# Altium schematic sheet Tay_Cam.SchDoc (part 1 of 3)
size 1270 x 558 mm; SheetNumber: 3; SheetTotal: 3
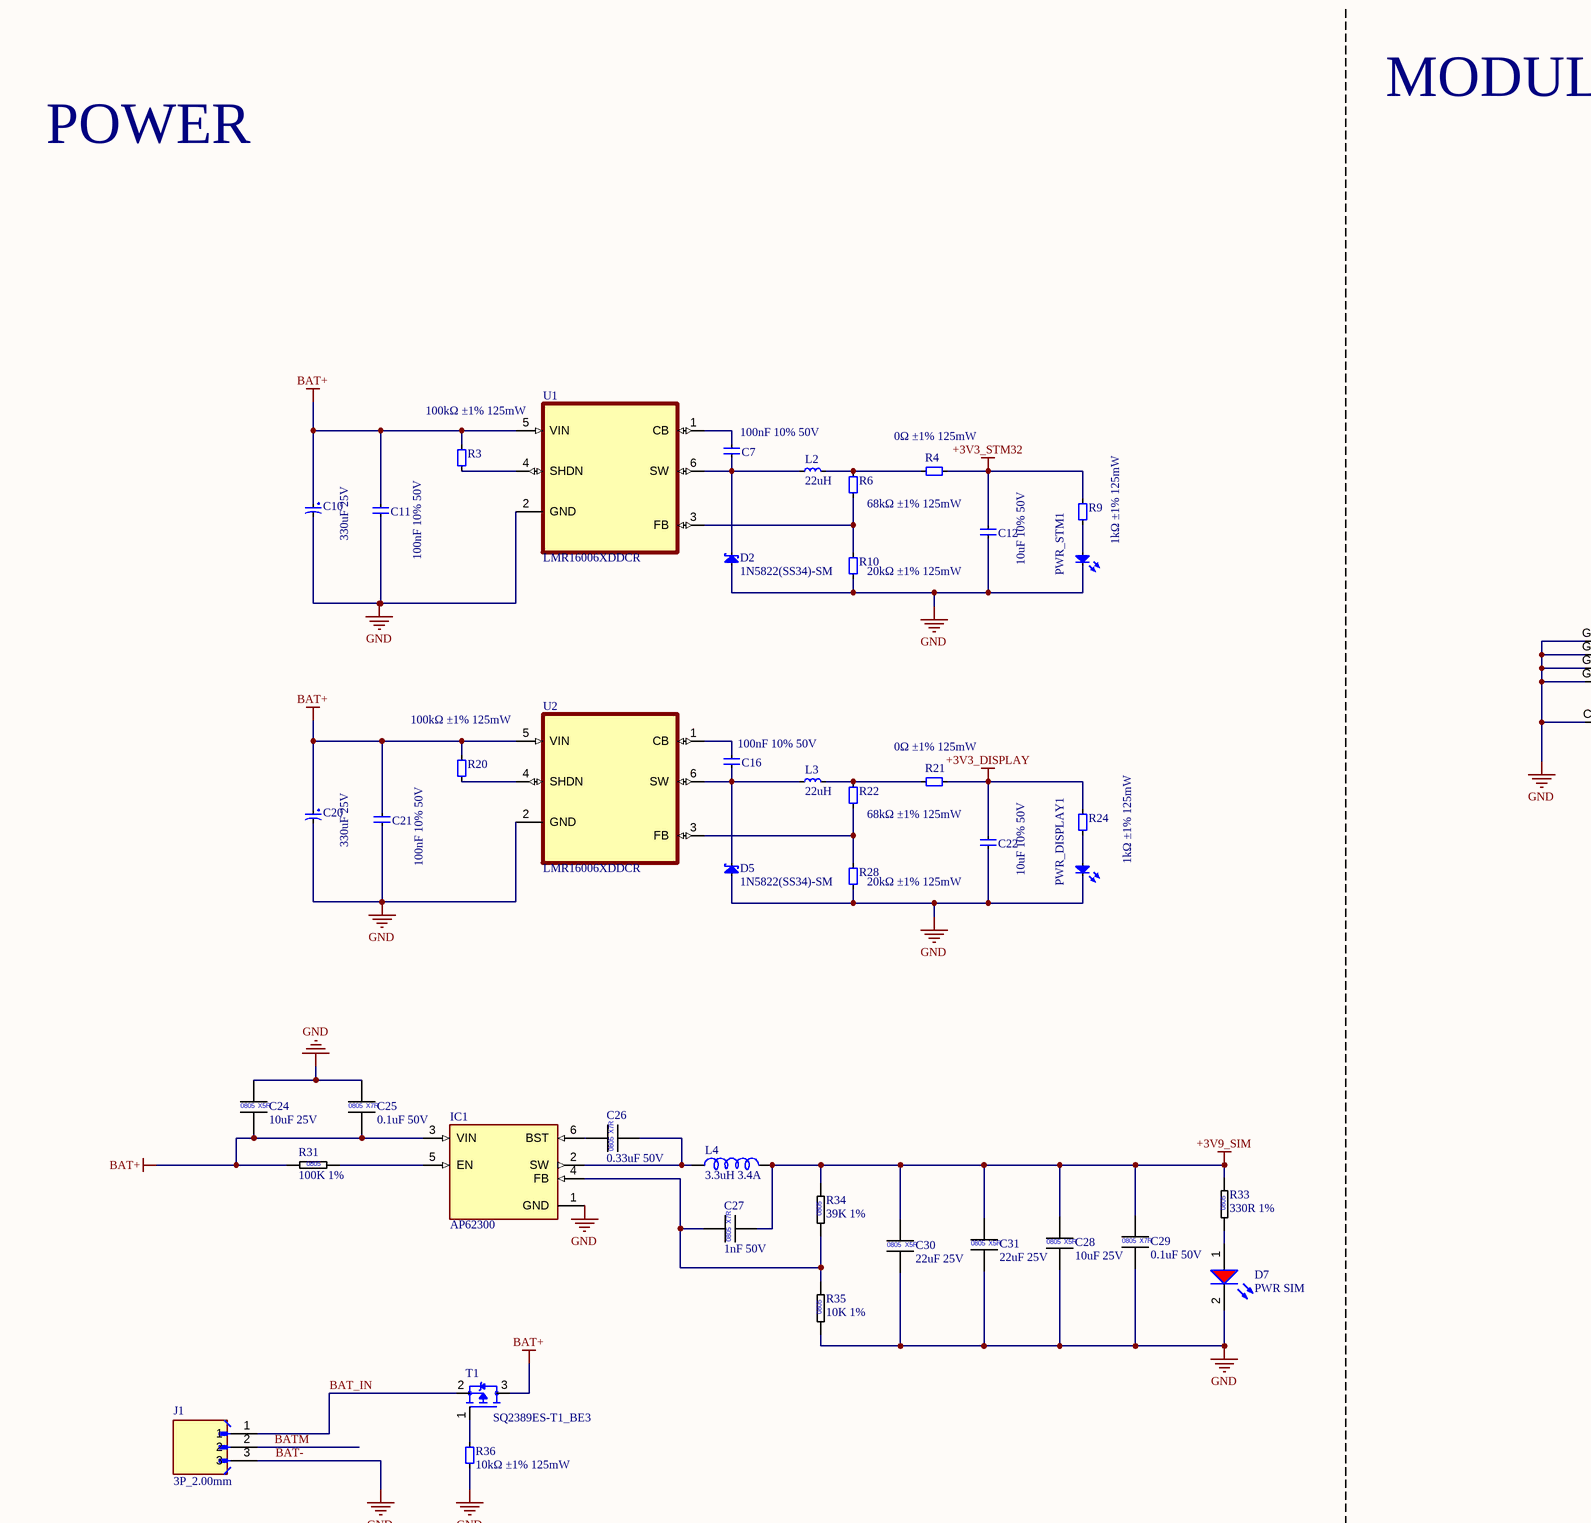
[diagram p0: Tay_Cam.SchDoc, top column 1 of 4]
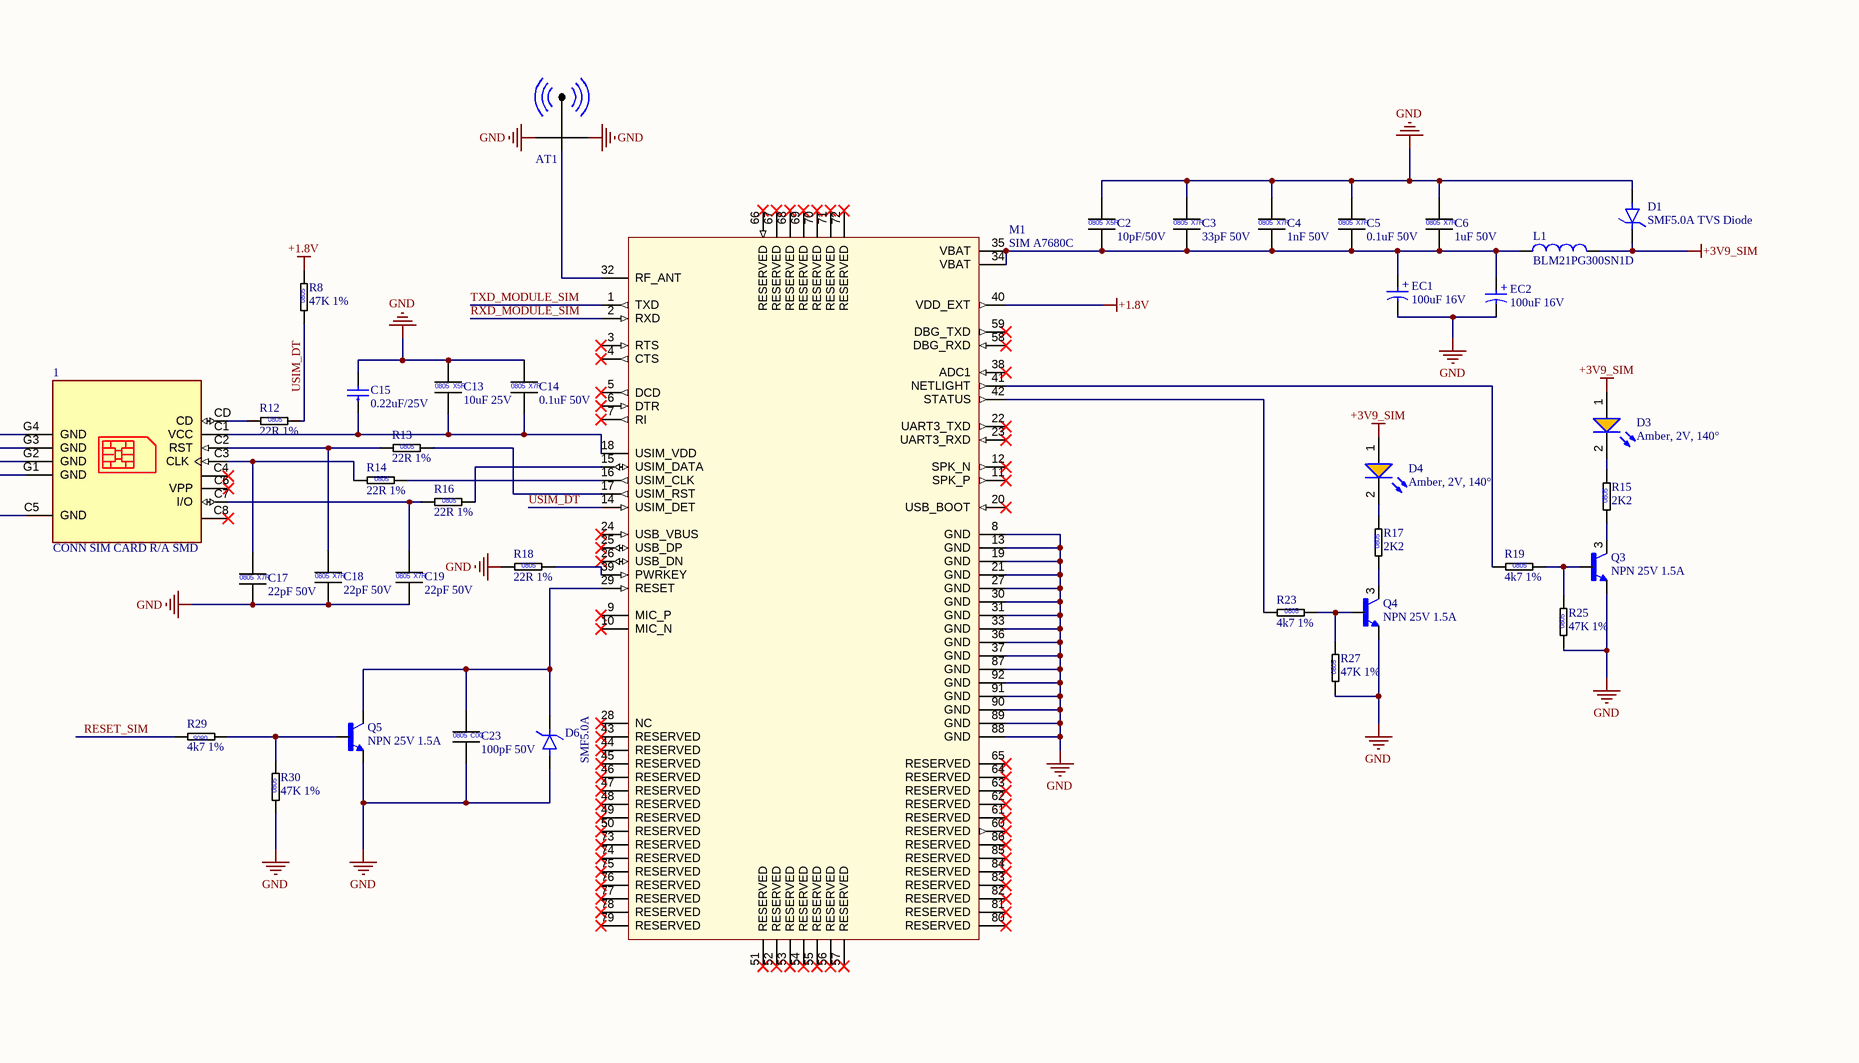
[diagram p1: Tay_Cam.SchDoc, top column 2 of 4]
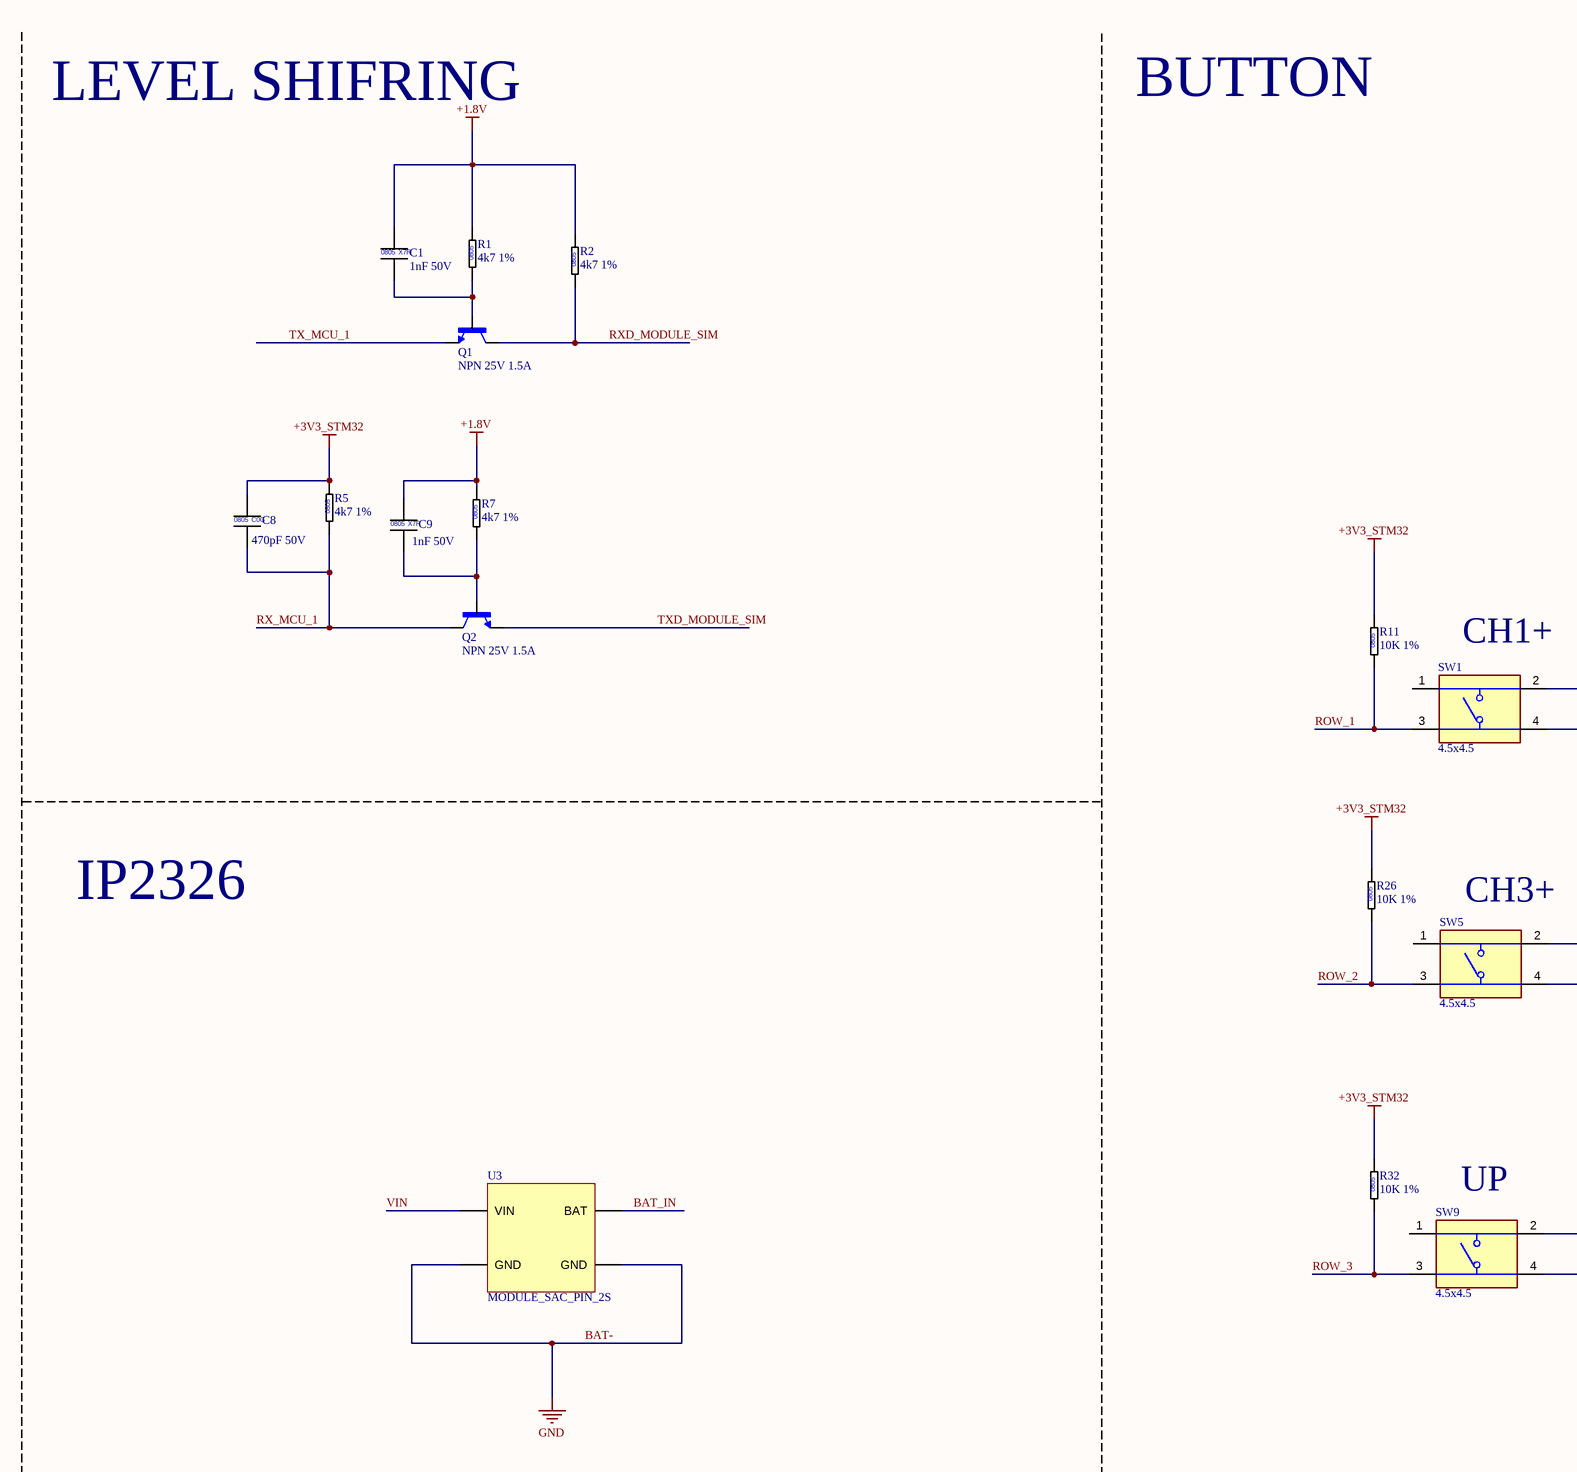
[diagram p2: Tay_Cam.SchDoc, top column 3 of 4]
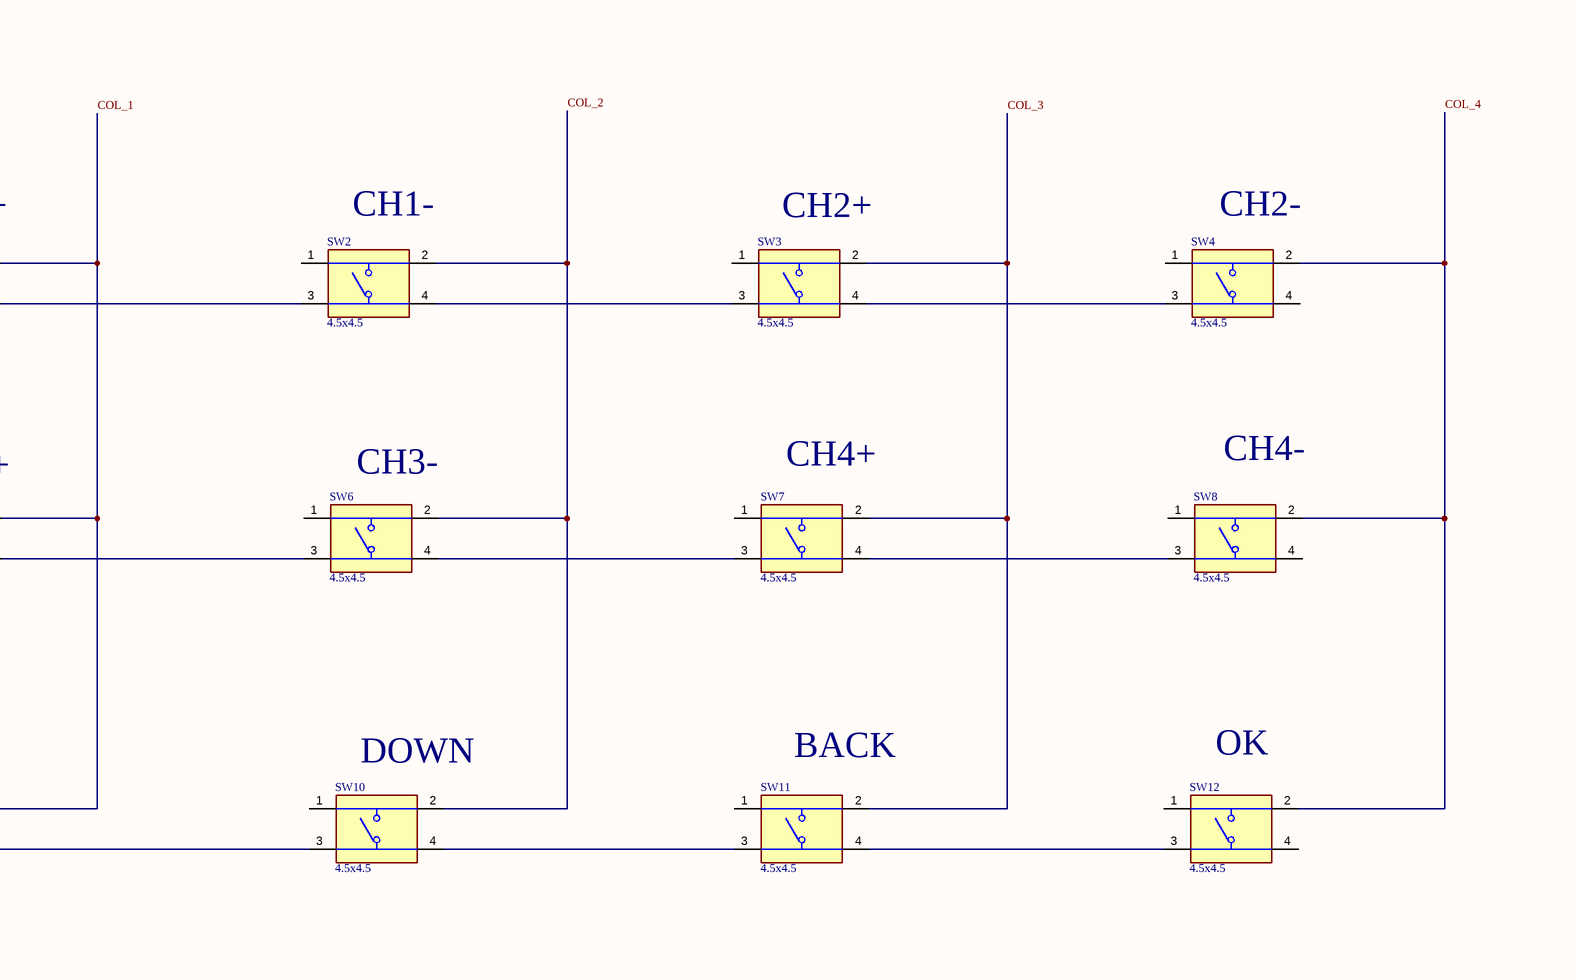
[diagram p3: Tay_Cam.SchDoc, top column 4 of 4]
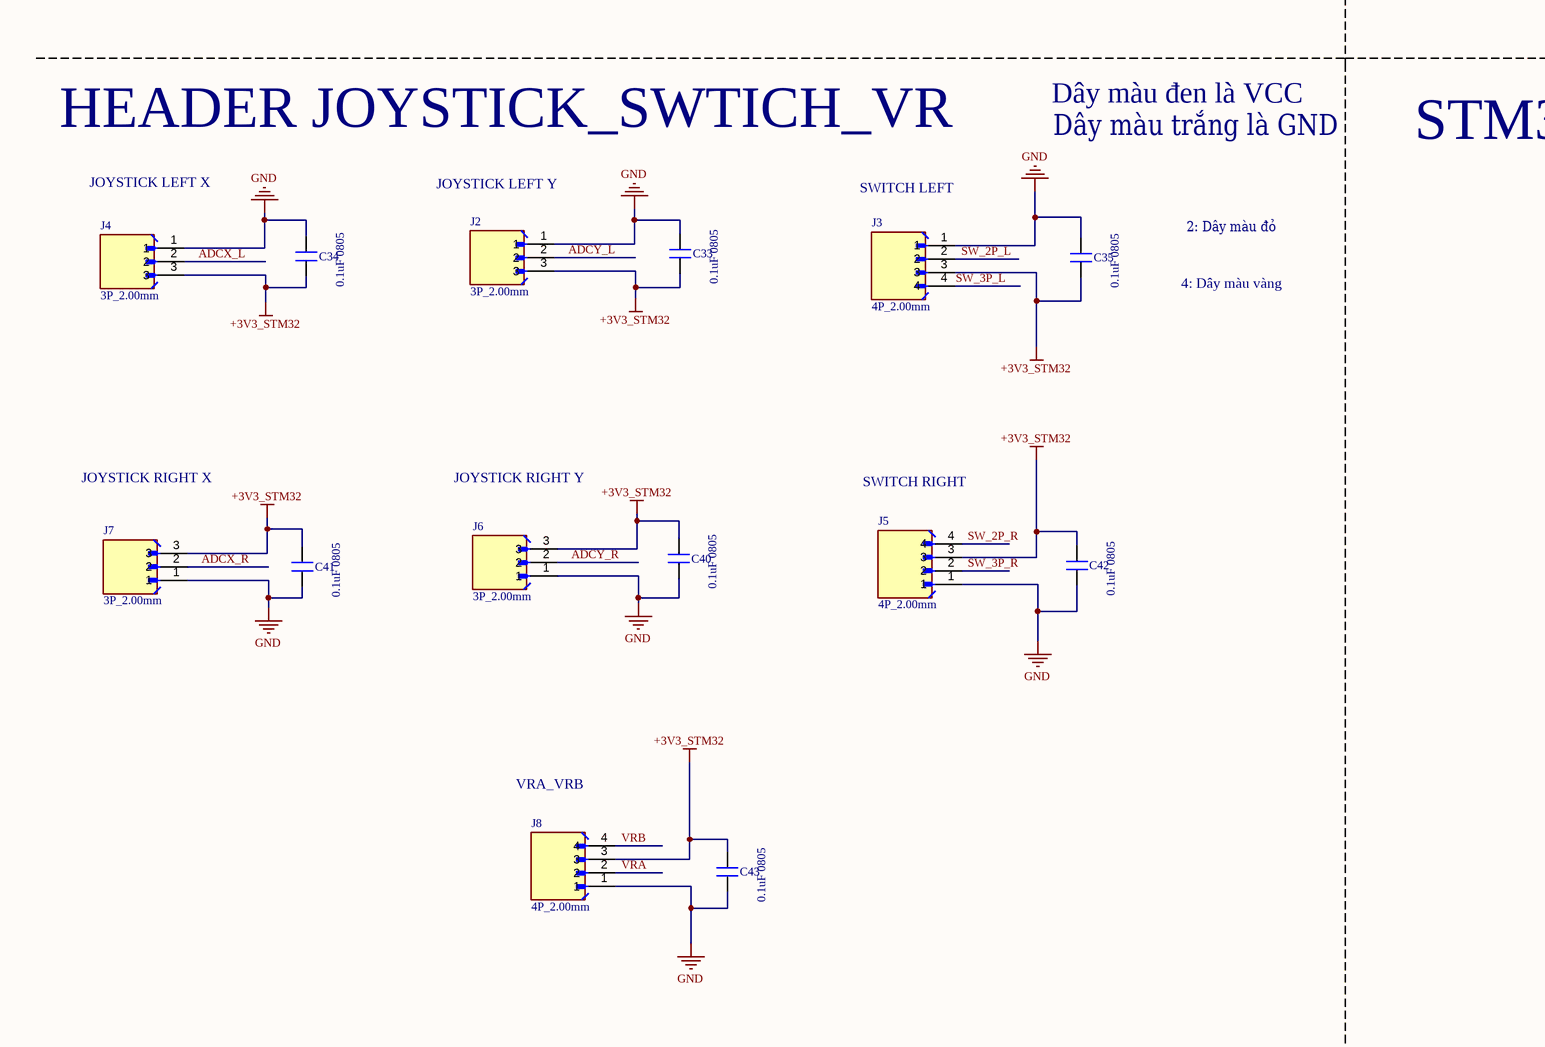
[diagram p4: Tay_Cam.SchDoc, bottom column 1 of 4]
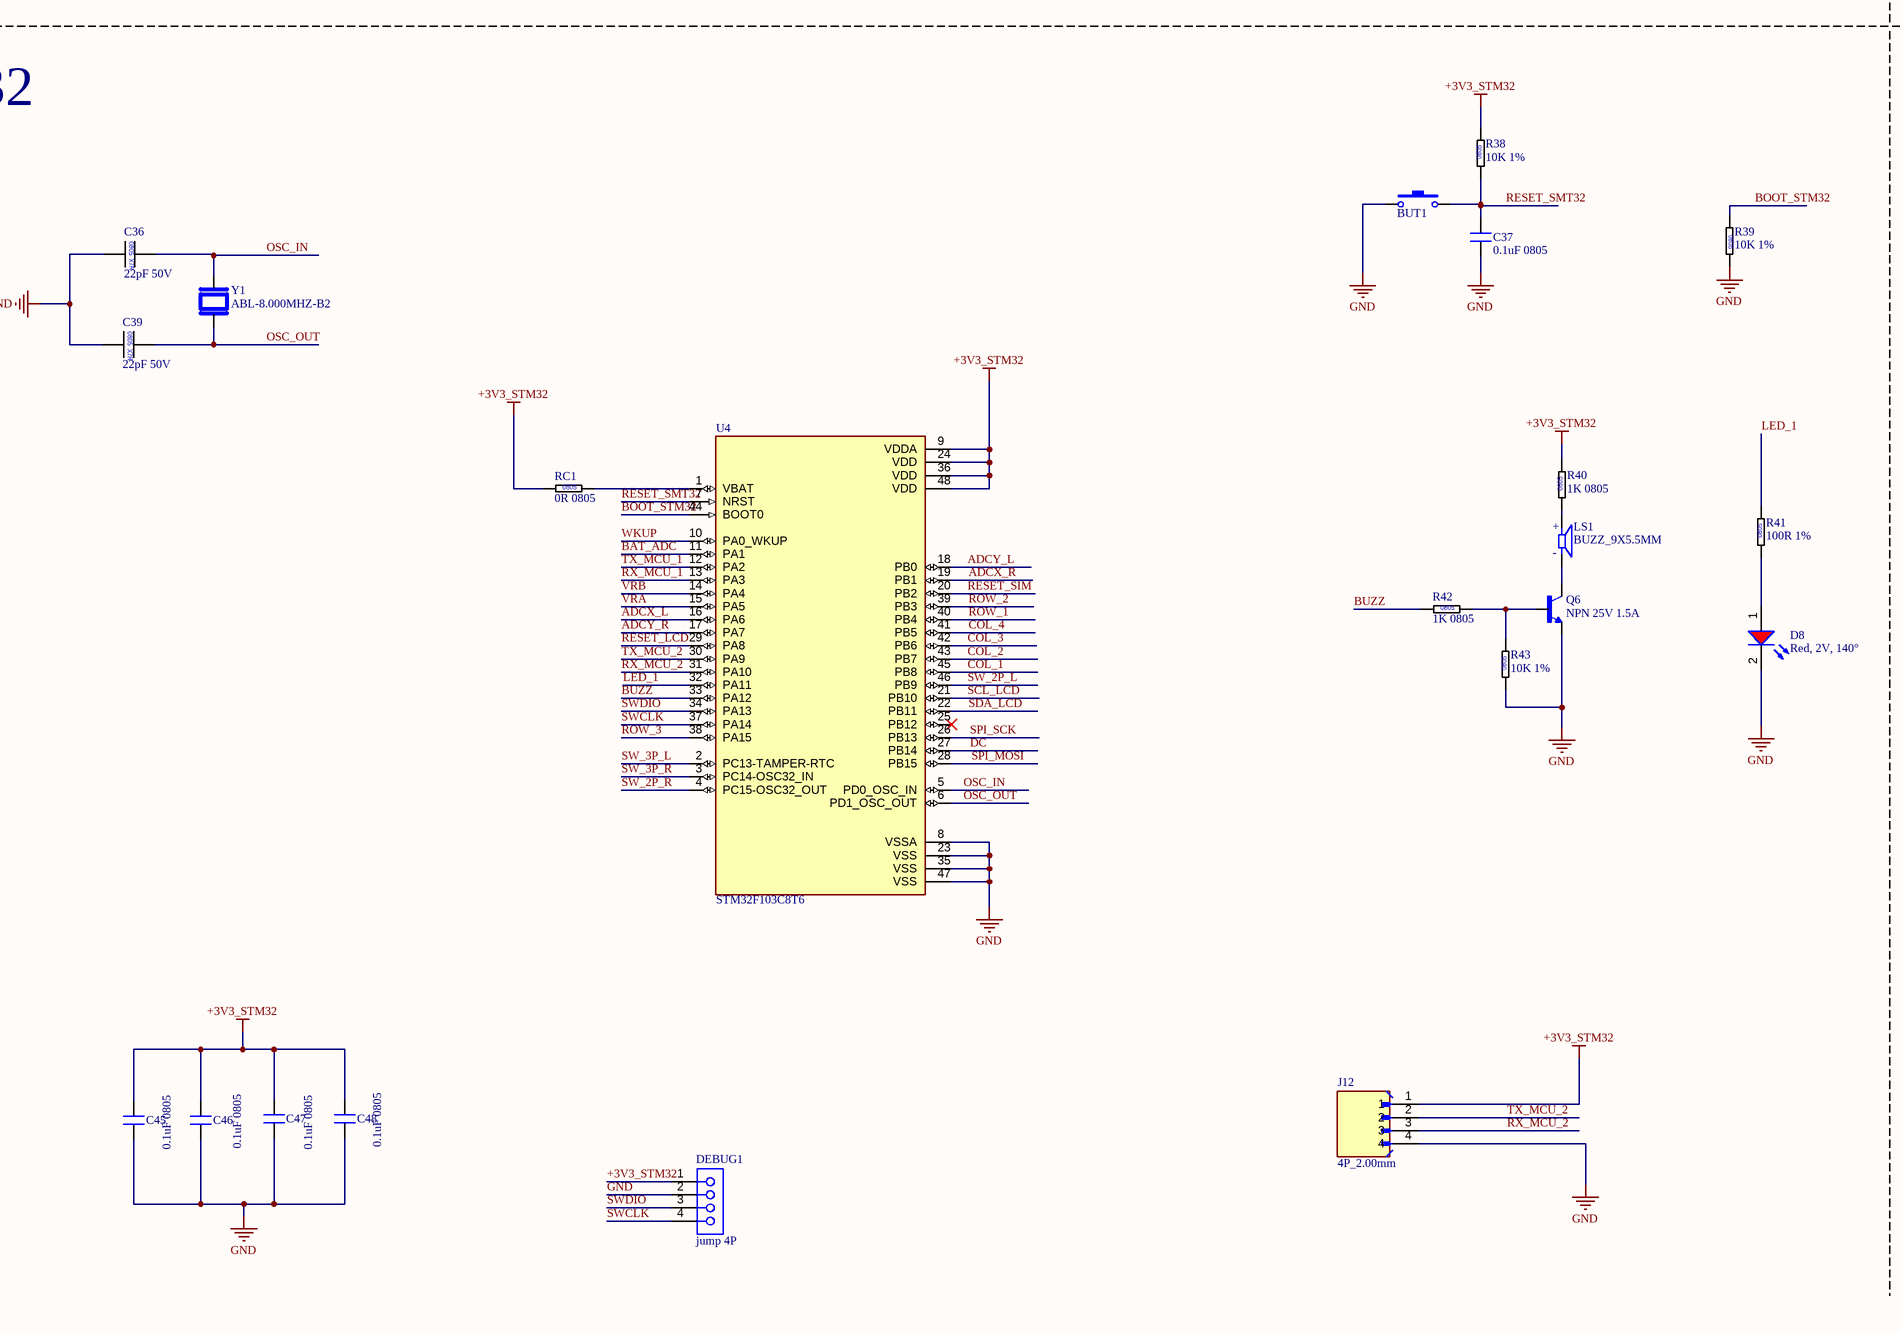
[diagram p5: Tay_Cam.SchDoc, bottom column 2 of 4]
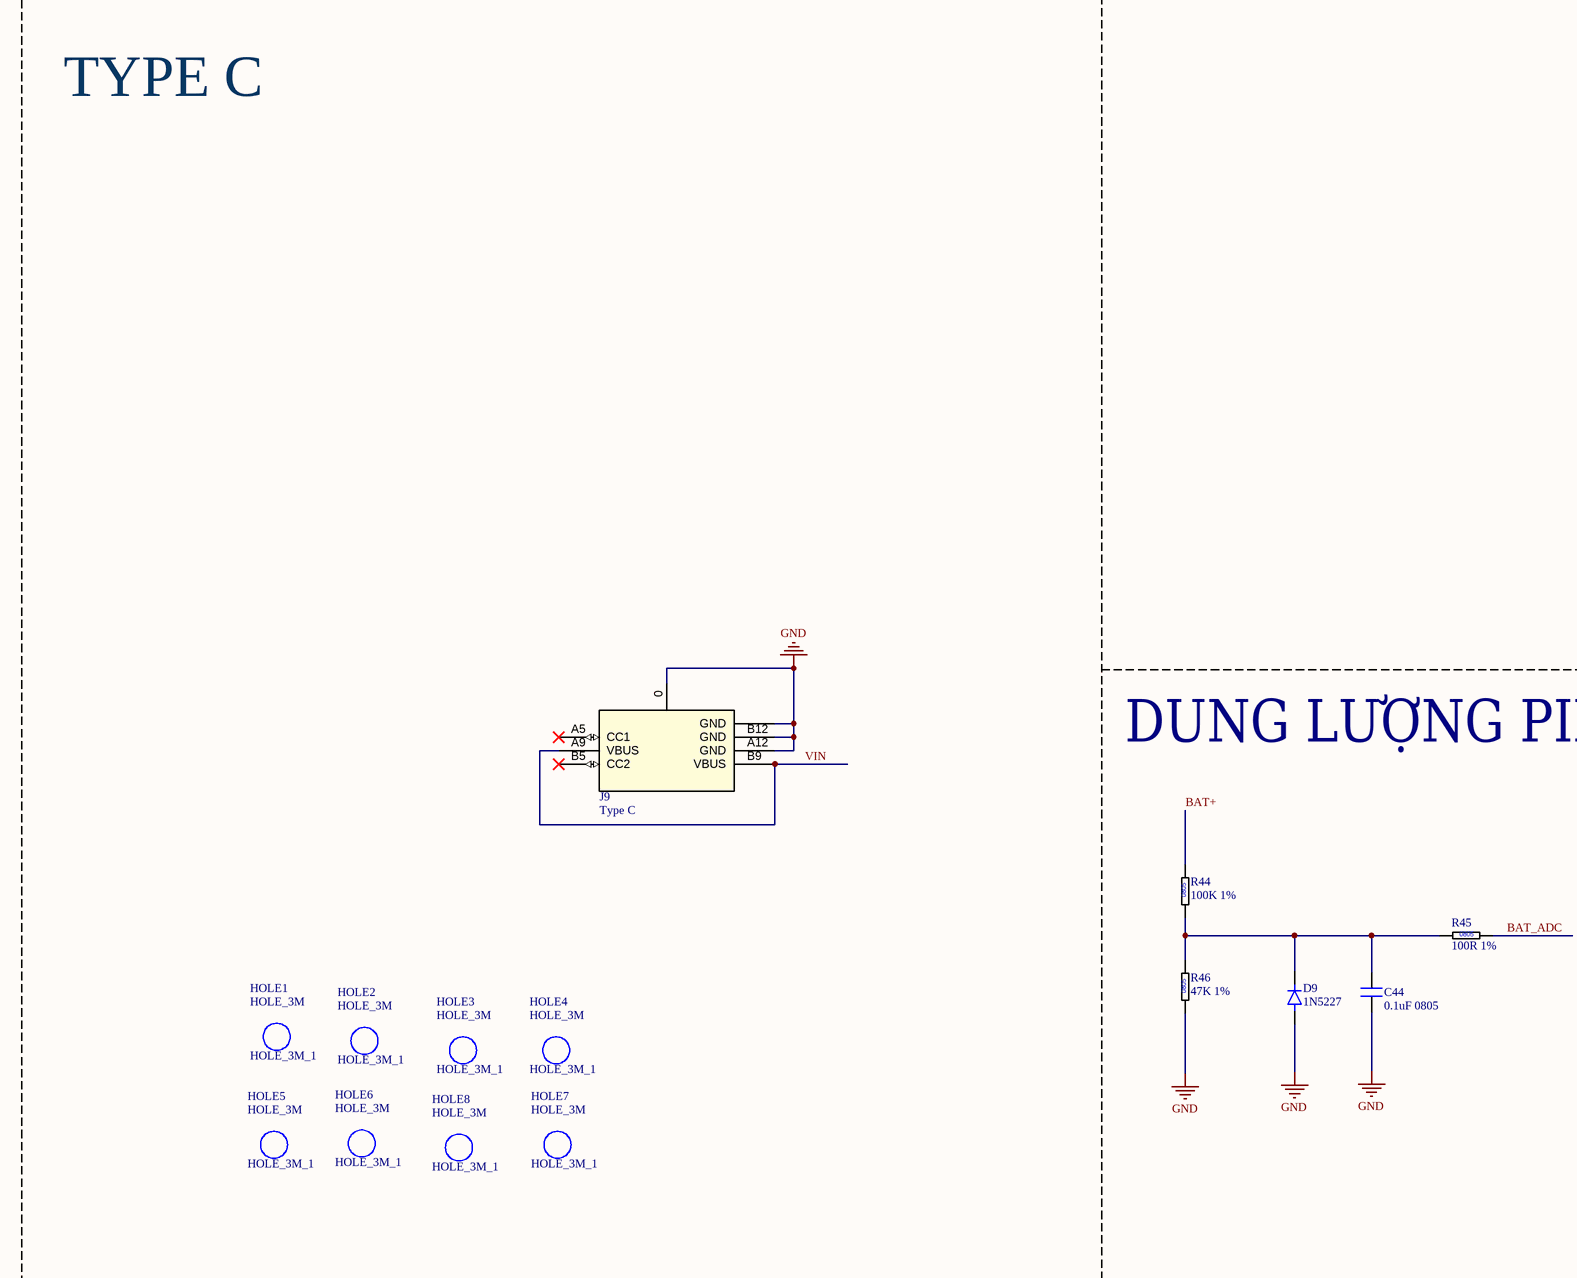
[diagram p6: Tay_Cam.SchDoc, bottom column 3 of 4]
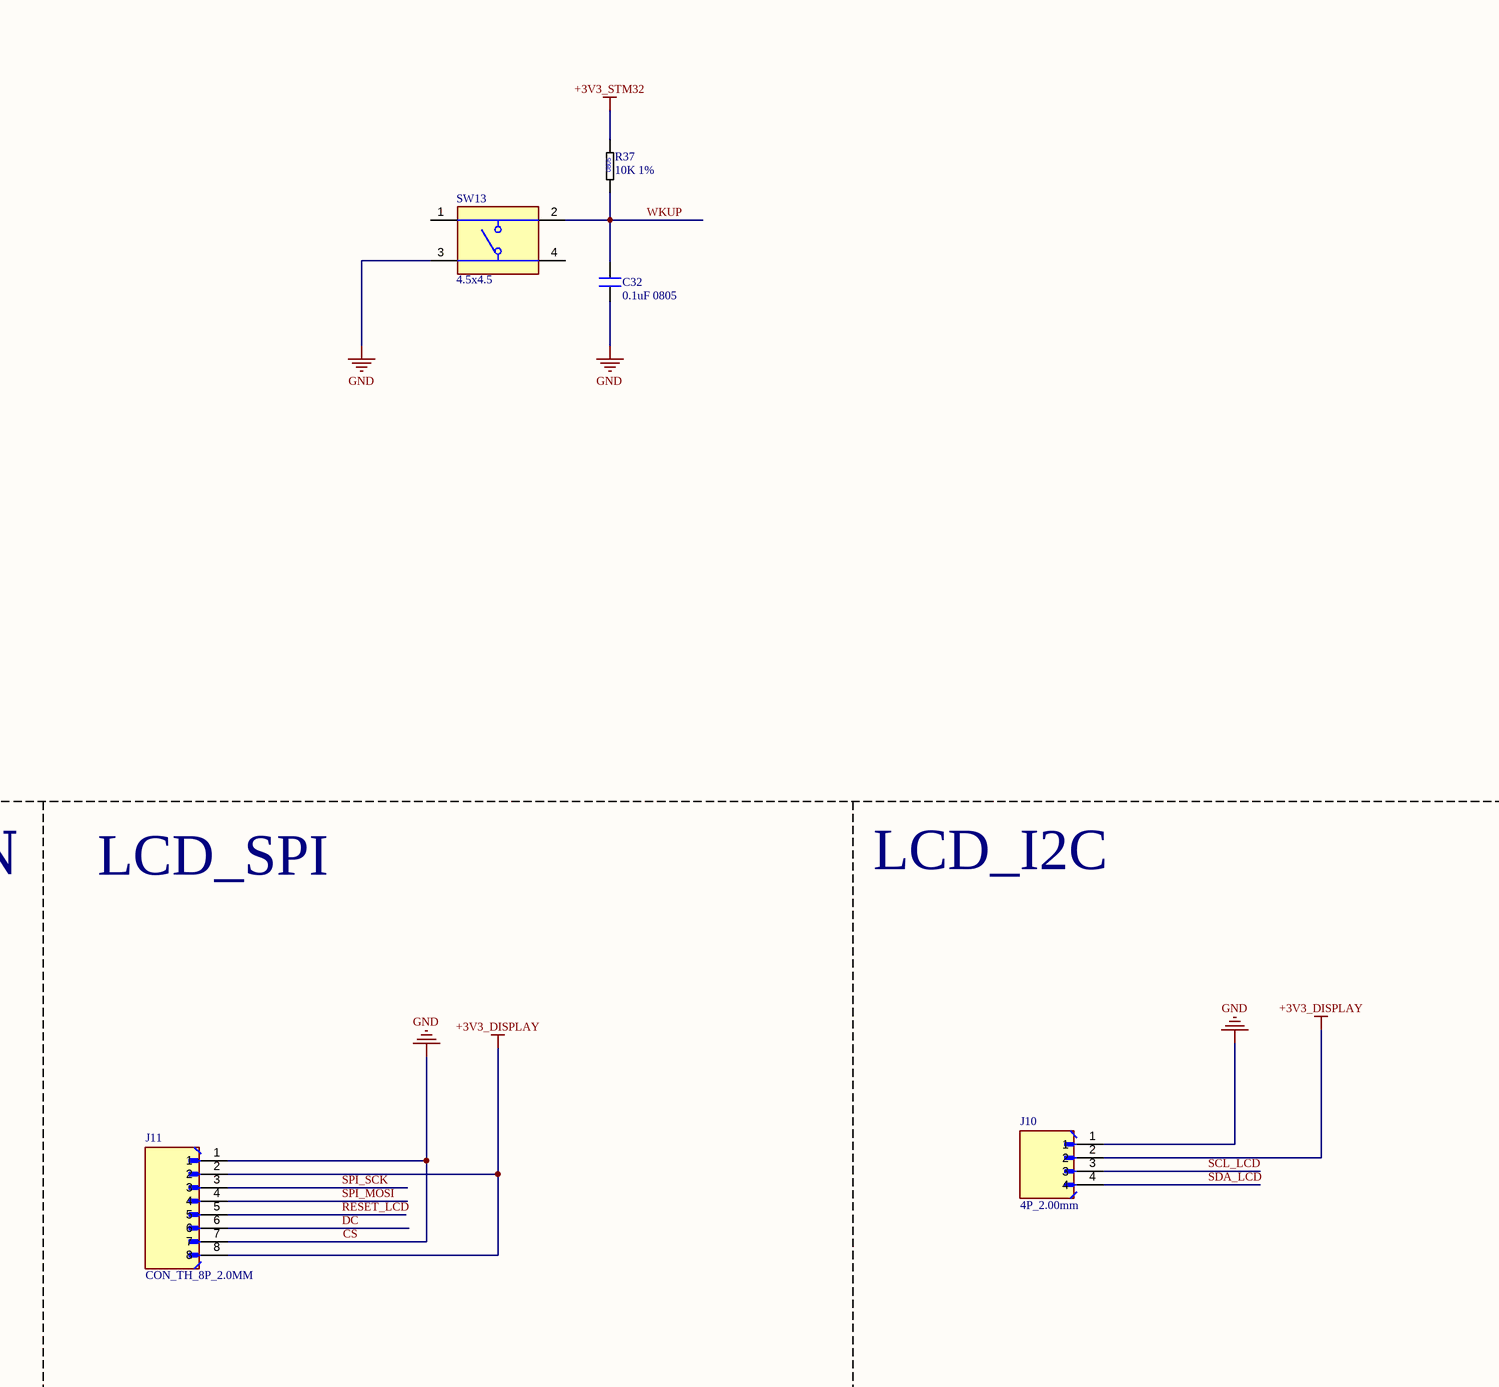
[diagram p7: Tay_Cam.SchDoc, bottom column 4 of 4]

## Parts
1  CONN SIM CARD R/A SMD  [SIM HOLDER 9P]
AT1  Antenna_IPEX  [IPEX]  (value not drawn)
BUT1  Nut Nhan 2 Chan SMD 3x6x2.5  [Nut Nhan 2 Chan SMD 3x6x2.5]  (value not drawn)
C1  1nF 50V  [CAP-CER_0805_L2W1.25H0.6_Wave]
C2  10pF/50V  [CAP-CER_0805_L2W1.25H0.6_Wave]
C3  33pF 50V  [CAP-CER_0805_L2W1.25H0.6_Wave]
C4  1nF 50V  [CAP-CER_0805_L2W1.25H0.6_Wave]
C5  0.1uF 50V  [CAP-CER_0805_L2W1.25H0.6_Wave]
C6  1uF 50V  [CAP-CER_0805_L2W1.25H0.8_Wave]
C7  100nF 10% 50V  [C-CHIP-0805-T0.95-SM]
C8  470pF 50V  [CAP-CER_0805_L2W1.25H0.6_Wave]
C9  1nF 50V  [CAP-CER_0805_L2W1.25H0.6_Wave]
C10  330uF 25V  [C-ELEC-ALU-F-D8.0-H10.2-SM]
C11  100nF 10% 50V  [C-CHIP-0805-T0.95-SM]
C12  10uF 10% 50V  [C-CHIP-1206-T1.00-SM]
C13  10uF 25V  [CAP-CER_0805_L2W1.25H0.8_Wave]
C14  0.1uF 50V  [CAP-CER_0805_L2W1.25H0.6_Wave]
C15  0.22uF/25V  [CAP-CER0805-1.4H]
C16  100nF 10% 50V  [C-CHIP-0805-T0.95-SM]
C17  22pF 50V  [CAP-CER_0805_L2W1.25H0.6_Wave]
C18  22pF 50V  [CAP-CER_0805_L2W1.25H0.6_Wave]
C19  22pF 50V  [CAP-CER_0805_L2W1.25H0.6_Wave]
C20  330uF 25V  [C-ELEC-ALU-F-D8.0-H10.2-SM]
C21  100nF 10% 50V  [C-CHIP-0805-T0.95-SM]
C22  10uF 10% 50V  [C-CHIP-1206-T1.00-SM]
C23  100pF 50V  [CAP-CER_0805_L2W1.25H0.6_Wave]
C24  10uF 25V  [CAP-CER_0805_L2W1.25H0.8_Wave]
C25  0.1uF 50V  [CAP-CER_0805_L2W1.25H0.6_Wave]
C26  0.33uF 50V  [CAP-CER_0805_L2W1.25H0.6_Wave]
C27  1nF 50V  [CAP-CER_0805_L2W1.25H0.6_Wave]
C28  10uF 25V  [CAP-CER_0805_L2W1.25H0.8_Wave]
C29  0.1uF 50V  [CAP-CER_0805_L2W1.25H0.6_Wave]
C30  22uF 25V  [CAP-CER_0805_L2W1.25H0.6_Wave]
C31  22uF 25V  [CAP-CER_0805_L2W1.25H0.6_Wave]
C32  0.1uF 0805  [CAP-CER_0603_L1.6W0.8H0.8_Wave]
C33  0.1uF 0805  [CAP-CER_0603_L1.6W0.8H0.8_Wave]
C34  0.1uF 0805  [CAP-CER_0603_L1.6W0.8H0.8_Wave]
C35  0.1uF 0805  [CAP-CER_0603_L1.6W0.8H0.8_Wave]
C36  22pF 50V  [CAP-CER_0805_L2W1.25H0.6_Wave]
C37  0.1uF 0805  [CAP-CER_0603_L1.6W0.8H0.8_Wave]
C39  22pF 50V  [CAP-CER_0805_L2W1.25H0.6_Wave]
C40  0.1uF 0805  [CAP-CER_0603_L1.6W0.8H0.8_Wave]
C41  0.1uF 0805  [CAP-CER_0603_L1.6W0.8H0.8_Wave]
C42  0.1uF 0805  [CAP-CER_0603_L1.6W0.8H0.8_Wave]
C43  0.1uF 0805  [CAP-CER_0603_L1.6W0.8H0.8_Wave]
C44  0.1uF 0805  [CAP-CER_0603_L1.6W0.8H0.8_Wave]
C45  0.1uF 0805  [CAP-CER_0603_L1.6W0.8H0.8_Wave]
C46  0.1uF 0805  [CAP-CER_0603_L1.6W0.8H0.8_Wave]
C47  0.1uF 0805  [CAP-CER_0603_L1.6W0.8H0.8_Wave]
C48  0.1uF 0805  [CAP-CER_0603_L1.6W0.8H0.8_Wave]
D1  SMF5.0A TVS Diode  [SOD-123]
D2  1N5822(SS34)-SM  [SMA-J_DO-214AC]
D3  Amber, 2V, 140°  [LED_0805_AMBER]
D4  Amber, 2V, 140°  [LED_0805_AMBER]
D5  1N5822(SS34)-SM  [SMA-J_DO-214AC]
D6  SMF5.0A  [SOD-123F/SOD-123FL]
D7  PWR SIM  [LED_0805_RED]
D8  Red, 2V, 140°  [LED_0805_RED]
D9  1N5227  [DIODE-SWITCHING_1N4148UR-1]
DEBUG1  jump 4P  [JUMP_M_1Sx4P_2.54MM]
EC1  100uF 16V  [CAP_ALU;SMD,D6.3H5.8]
EC2  100uF 16V  [CAP_ALU;SMD,D6.3H5.8]
HOLE1  HOLE_3M_1  [HOLE_M3_1]
HOLE2  HOLE_3M_1  [HOLE_M3_1]
HOLE3  HOLE_3M_1  [HOLE_M3_1]
HOLE4  HOLE_3M_1  [HOLE_M3_1]
HOLE5  HOLE_3M_1  [HOLE_M3_1]
HOLE6  HOLE_3M_1  [HOLE_M3_1]
HOLE7  HOLE_3M_1  [HOLE_M3_1]
HOLE8  HOLE_3M_1  [HOLE_M3_1]
IC1  AP62300  [SOT-23-6]
J1  3P_2.00mm  [JST_B3B-PH-K-S(LF)(SN)]
J2  3P_2.00mm  [JST_B3B-PH-K-S(LF)(SN)]
J3  4P_2.00mm  [JST_B4B-PH-K-S(LF)(SN)]
J4  3P_2.00mm  [JST_B3B-PH-K-S(LF)(SN)]
J5  4P_2.00mm  [JST_B4B-PH-K-S(LF)(SN)]
J6  3P_2.00mm  [JST_B3B-PH-K-S(LF)(SN)]
J7  3P_2.00mm  [JST_B3B-PH-K-S(LF)(SN)]
J8  4P_2.00mm  [JST_B4B-PH-K-S(LF)(SN)]
J9  Type C  [USB_C_6P_2.00]
J10  4P_2.00mm  [JST_B4B-PH-K-S(LF)(SN)]
J11  CON_TH_8P_2.0MM  [JST_B8B-PH-K-S]
J12  4P_2.00mm  [JST_B4B-PH-K-S(LF)(SN)]
L1  BLM21PG300SN1D  [FB_0805_L2W1.2H0.9_HC]
L2  22uH  [L-WIRE-CDRH74R-SM]
L3  22uH  [L-WIRE-CDRH74R-SM]
L4  3.3uH 3.4A  [IND_SMD 6x6x2.8MM]
LS1  BUZZ_9X5.5MM  [CUI_CST-931AP]
M1  SIM A7680C  [IC_SIM_A7682S/A7680C - duplicate]
PWR_DISPLAY1  LED-CHIP-SM  [LED-CHIP-0805-RD-SM]  (value not drawn)
PWR_STM1  LED-CHIP-SM  [LED-CHIP-0805-RD-SM]  (value not drawn)
Q1  NPN 25V 1.5A  [MOS-FET; SOT23]
Q2  NPN 25V 1.5A  [MOS-FET; SOT23]
Q3  NPN 25V 1.5A  [MOS-FET; SOT23]
Q4  NPN 25V 1.5A  [MOS-FET; SOT23]
Q5  NPN 25V 1.5A  [MOS-FET; SOT23]
Q6  NPN 25V 1.5A  [MOS-FET; SOT23]
R1  4k7 1%  [RESISTOR_0805_Wave]
R2  4k7 1%  [RESISTOR_0805_Wave]
R3  100kΩ ±1% 125mW  [R-CHIP-0805-SM]
R4  0Ω ±1% 125mW  [R-CHIP-0805-SM]
R5  4k7 1%  [RESISTOR_0805_Wave]
R6  68kΩ ±1% 125mW  [R-CHIP-0805-SM]
R7  4k7 1%  [RESISTOR_0805_Wave]
R8  47K 1%  [RESISTOR_0805_Wave]
R9  1kΩ ±1% 125mW  [R-CHIP-0805-SM]
R10  20kΩ ±1% 125mW  [R-CHIP-0805-SM]
R11  10K 1%  [RESISTOR_0805_Wave]
R12  22R 1%  [RESISTOR_0805_Wave]
R13  22R 1%  [RESISTOR_0805_Wave]
R14  22R 1%  [RESISTOR_0805_Wave]
R15  2K2  [RESISTOR_0805_Wave]
R16  22R 1%  [RESISTOR_0805_Wave]
R17  2K2  [RESISTOR_0805_Wave]
R18  22R 1%  [RESISTOR_0805_Wave]
R19  4k7 1%  [RESISTOR_0805_Wave]
R20  100kΩ ±1% 125mW  [R-CHIP-0805-SM]
R21  0Ω ±1% 125mW  [R-CHIP-0805-SM]
R22  68kΩ ±1% 125mW  [R-CHIP-0805-SM]
R23  4k7 1%  [RESISTOR_0805_Wave]
R24  1kΩ ±1% 125mW  [R-CHIP-0805-SM]
R25  47K 1%  [RESISTOR_0805_Wave]
R26  10K 1%  [RESISTOR_0805_Wave]
R27  47K 1%  [RESISTOR_0805_Wave]
R28  20kΩ ±1% 125mW  [R-CHIP-0805-SM]
R29  4k7 1%  [RESISTOR_0805_Wave]
R30  47K 1%  [RESISTOR_0805_Wave]
R31  100K 1%  [RESISTOR_0805_Wave]
R32  10K 1%  [RESISTOR_0805_Wave]
R33  330R 1%  [RESISTOR_0805_Wave]
R34  39K 1%  [RESISTOR_0805_Wave]
R35  10K 1%  [RESISTOR_0805_Wave]
R36  10kΩ ±1% 125mW  [R-CHIP-0805-SM]
R37  10K 1%  [RESISTOR_0805_Wave]
R38  10K 1%  [RESISTOR_0805_Wave]
R39  10K 1%  [RESISTOR_0805_Wave]
R40  1K 0805  [RESISTOR_0805_Wave]
R41  100R 1%  [RESISTOR_0805_Reflow]
R42  1K 0805  [RESISTOR_0805_Wave]
R43  10K 1%  [RESISTOR_0805_Wave]
R44  100K 1%  [RESISTOR_0805_Wave]
R45  100R 1%  [RESISTOR_0805_Reflow]
R46  47K 1%  [RESISTOR_0805_Wave]
RC1  0R 0805  [RESISTOR_0603_Wave]
SW1  4.5x4.5  [SWITCH_SMD_4P_4.5x4.5x3.8MM - duplicate]
SW2  4.5x4.5  [SWITCH_SMD_4P_4.5x4.5x3.8MM - duplicate]
SW3  4.5x4.5  [SWITCH_SMD_4P_4.5x4.5x3.8MM - duplicate]
SW4  4.5x4.5  [SWITCH_SMD_4P_4.5x4.5x3.8MM - duplicate]
SW5  4.5x4.5  [SWITCH_SMD_4P_4.5x4.5x3.8MM - duplicate]
SW6  4.5x4.5  [SWITCH_SMD_4P_4.5x4.5x3.8MM - duplicate]
SW7  4.5x4.5  [SWITCH_SMD_4P_4.5x4.5x3.8MM - duplicate]
SW8  4.5x4.5  [SWITCH_SMD_4P_4.5x4.5x3.8MM - duplicate]
SW9  4.5x4.5  [SWITCH_SMD_4P_4.5x4.5x3.8MM - duplicate]
SW10  4.5x4.5  [SWITCH_SMD_4P_4.5x4.5x3.8MM - duplicate]
SW11  4.5x4.5  [SWITCH_SMD_4P_4.5x4.5x3.8MM - duplicate]
SW12  4.5x4.5  [SWITCH_SMD_4P_4.5x4.5x3.8MM - duplicate]
SW13  4.5x4.5  [SWITCH_SMD_4P_4.5x4.5x3.8MM - duplicate]
T1  SQ2389ES-T1_BE3  [SOT-23]
U1  LMR16006XDDCR  [SOT-6L]
U2  LMR16006XDDCR  [SOT-6L]
U3  MODULE_SAC_PIN_2S  [MODULE_SAC_PIN_2S]
U4  STM32F103C8T6  [QFP50P900X900X160-48N]
Y1  ABL-8.000MHZ-B2  [XTAL_HC49P488W46L1150T500H350]

## Nets
+1.8V: C1.1 C9.1 M1.40(VDD_EXT) R1.2 R2.2 R7.2 R8.2
+3V3_DISPLAY: C22.2 J10.2 J11.2 J11.8 R21.2 R24.2
+3V3_STM32: C8.1 C12.2 C33.1 C34.1 C35.1 C40.2 C41.2 C42.2 C43.2 C45.2 C46.2 C47.2 C48.2 DEBUG1.1 J2.3 J3.3 J4.3 J5.3 J6.3 J7.3 J8.3 J12.1 R4.2 R5.2 R9.2 R11.2 R26.2 R32.2 R37.2 R38.2 R40.2 RC1.1 U4.9(VDDA) U4.24(VDD) U4.36(VDD) U4.48(VDD)
+3V9_SIM: C27.2 C28.1 C29.1 C30.1 C31.1 D1.2(K) D3.1(A) D4.1(A) L1.2 L4.2 R33.2 R34.2
BAT+: C10.1 C11.2 C20.1 C21.2 C24.2 C25.2 IC1.3(VIN) R3.2 R20.2 R31.1 R44.2 T1.3(D) U1.5(VIN) U2.5(VIN)
BAT-: 1.C5(GND) 1.G1(GND) 1.G2(GND) 1.G3(GND) 1.G4(GND) AT1.2(GND) BUT1.1 C2.1 C3.1 C4.1 C5.1 C6.1 C10.2 C11.1 C12.1 C13.1 C14.1 C15.2 C17.2 C18.2 C19.2 C20.2 C21.1 C22.1 C23.2 C24.1 C25.1 C28.2 C29.2 C30.2 C31.2 C32.2 C33.2 C34.2 C35.2 C36.2 C37.2 C39.2 C40.1 C41.1 C42.1 C43.1 C44.2 C45.1 C46.1 C47.1 C48.1 D1.1(A) D2.1 D5.1 D6.1(A) D7.2(K) D8.2(K) D9.1(A) DEBUG1.2 EC1.2(N) EC2.2(N) IC1.1(GND) J1.3 J2.1 J3.1 J4.1 J5.1 J6.1 J7.1 J8.1 J9.0(GND) J9.A12(GND) J9.B12(GND) J10.1 J11.1 J11.7 J12.4 M1.8(GND) M1.13(GND) M1.19(GND) M1.21(GND) M1.27(GND) M1.30(GND) M1.31(GND) M1.33(GND) M1.36(GND) M1.37(GND) M1.87(GND) M1.88(GND) M1.89(GND) M1.90(GND) M1.91(GND) M1.92(GND) PWR_DISPLAY1.2 PWR_STM1.2 Q3.2(E) Q4.2(E) Q5.2(E) Q6.2(E) R10.1 R18.1 R25.1 R27.1 R28.1 R30.1 R35.1 R36.1 R39.2 R43.1 R46.1 SW13.3 U1.2(GND) U2.2(GND) U3.GND U4.8(VSSA) U4.23(VSS) U4.35(VSS) U4.47(VSS)  [also labelled CS, GND]
ADCX_L: J4.2 U4.16(PA6)
ADCX_R: J7.2 U4.19(PB1)
ADCY_L: J2.2 U4.18(PB0)
ADCY_R: J6.2 U4.17(PA7)
BAT_ADC: R45.2 U4.11(PA1)
BAT_IN: J1.1 T1.2(S) U3.BAT
BATM: J1.2
BOOT_STM32: R39.1 U4.44(BOOT0)
BUZZ: R42.1 U4.33(PA12)
COL_1: SW1.2 SW5.2 SW9.2 U4.45(PB8)
COL_2: SW2.2 SW6.2 SW10.2 U4.43(PB7)
COL_3: SW3.2 SW7.2 SW11.2 U4.42(PB6)
COL_4: SW4.2 SW8.2 SW12.2 U4.41(PB5)
DC: J11.6 U4.27(PB14)
LED_1: R41.2 U4.32(PA11)
OSC_IN: C36.1 U4.5(PD0_OSC_IN) Y1.2
OSC_OUT: C39.1 U4.6(PD1_OSC_OUT) Y1.1
RESET_LCD: J11.5 U4.29(PA8)
RESET_SIM: R29.2 U4.20(PB2)
RESET_SMT32: BUT1.2 C37.1 R38.1 U4.7(NRST)
ROW_1: R11.1 SW1.3 U4.40(PB4)
ROW_2: R26.1 SW5.3 U4.39(PB3)
ROW_3: R32.1 SW9.3 U4.38(PA15)
RX_MCU_1: C8.2 Q2.3(C) R5.1 U4.13(PA3)
RX_MCU_2: J12.3 U4.31(PA10)
RXD_MODULE_SIM: M1.2(RXD) Q1.3(C) R2.1
SCL_LCD: J10.3 U4.21(PB10)
SDA_LCD: J10.4 U4.22(PB11)
SPI_MOSI: J11.4 U4.28(PB15)
SPI_SCK: J11.3 U4.26(PB13)
SW_2P_L: J3.2 U4.46(PB9)
SW_2P_R: J5.4 U4.4(PC15-OSC32_OUT)
SW_3P_L: J3.4 U4.2(PC13-TAMPER-RTC)
SW_3P_R: J5.2 U4.3(PC14-OSC32_IN)
SWCLK: DEBUG1.4 U4.37(PA14)
SWDIO: DEBUG1.3 U4.34(PA13)
TX_MCU_1: Q1.2(E) U4.12(PA2)
TX_MCU_2: J12.2 U4.30(PA9)
TXD_MODULE_SIM: M1.1(TXD) Q2.2(E)
USIM_DT: M1.14(USIM_DET) R8.1 R12.2
VIN: J9.A9(VBUS) J9.B9(VBUS) U3.VIN
VRA: J8.2 U4.15(PA5)
VRB: J8.4 U4.14(PA4)
WKUP: C32.1 R37.1 SW13.2 U4.10(PA0_WKUP)
Net1_C1: 1.C1(VCC) C13.2 C14.2 C15.1 M1.18(USIM_VDD)
Net1_C2: 1.C2(RST) C18.1 R13.1
Net1_C3: 1.C3(CLK) C17.1 R14.1
Net1_C7: 1.C7(I/O) C19.1 R16.1
Net1_CD: 1.CD R12.1
NetAT1_1: AT1.1(AT) M1.32(RF_ANT)
NetC1_2: C1.2 Q1.1(B) R1.1
NetC2_2: C2.2 C3.2 C4.2 C5.2 C6.2 EC1.1(P) EC2.1(P) L1.1 M1.34(VBAT) M1.35(VBAT)
NetC7_1: C7.1 D2.2 L2.1 U1.6(SW)
NetC7_2: C7.2 U1.1(CB)
NetC9_2: C9.2 Q2.1(B) R7.1
NetC16_1: C16.1 D5.2 L3.1 U2.6(SW)
NetC16_2: C16.2 U2.1(CB)
NetC23_1: C23.1 D6.2(K) M1.29(RESET) Q5.3(C)
NetC26_1: C26.1 IC1.6(BST)
NetC26_2: C26.2 IC1.2(SW) L4.1
NetC27_1: C27.1 IC1.4(FB) R34.1 R35.2
NetC44_1: C44.1 D9.2(K) R44.1 R45.1 R46.2
NetD3_2: D3.2(K) R15.2
NetD4_2: D4.2(K) R17.2
NetD7_1: D7.1(A) R33.1
NetD8_1: D8.1(A) R41.1
NetIC1_5: IC1.5(EN) R31.2
NetL2_2: L2.2 R4.1 R6.2
NetL3_2: L3.2 R21.1 R22.2
NetLS1_M: LS1.M Q6.3(C)
NetLS1_P: LS1.P R40.1
NetM1_15: M1.15(USIM_DATA) R16.2
NetM1_16: M1.16(USIM_CLK) R14.2
NetM1_17: M1.17(USIM_RST) R13.2
NetM1_39: M1.39(PWRKEY) R18.2
NetM1_41: M1.41(NETLIGHT) R19.1
NetM1_42: M1.42(STATUS) R23.1
NetPWR_DISPLAY1_1: PWR_DISPLAY1.1 R24.1
NetPWR_STM1_1: PWR_STM1.1 R9.1
NetQ3_1: Q3.1(B) R19.2 R25.2
NetQ3_3: Q3.3(C) R15.1
NetQ4_1: Q4.1(B) R23.2 R27.2
NetQ4_3: Q4.3(C) R17.1
NetQ5_1: Q5.1(B) R29.1 R30.2
NetQ6_1: Q6.1(B) R42.2 R43.2
NetR3_1: R3.1 U1.4(SHDN)
NetR6_1: R6.1 R10.2 U1.3(FB)
NetR20_1: R20.1 U2.4(SHDN)
NetR22_1: R22.1 R28.2 U2.3(FB)
NetR36_2: R36.2 T1.1(G)
NetRC1_2: RC1.2 U4.1(VBAT)
NetSW1_4: SW1.4 SW2.3
NetSW2_4: SW2.4 SW3.3
NetSW3_4: SW3.4 SW4.3
NetSW5_4: SW5.4 SW6.3
NetSW6_4: SW6.4 SW7.3
NetSW7_4: SW7.4 SW8.3
NetSW9_4: SW9.4 SW10.3
NetSW10_4: SW10.4 SW11.3
NetSW11_4: SW11.4 SW12.3

Not connected (* = marked no-connect by the designer): 1 C4* C6(VPP)* C8*; J9 A5(CC1)* B5(CC2)*; M1 3(RTS)* 4(CTS)* 5(DCD)* 6(DTR)* 7(RI)* 9(MIC_P)* 10(MIC_N)* 11(SPK_P)* 12(SPK_N)* 20(USB_BOOT)* 22(UART3_TXD)* 23(UART3_RXD)* 24(USB_VBUS)* 25(USB_DP)* 26(USB_DN)* 28(NC)* 38(ADC1)* 43(RESERVED)* 44(RESERVED)* 45(RESERVED)* 46(RESERVED)* 47(RESERVED)* 48(RESERVED)* 49(RESERVED)* 50(RESERVED)* 51(RESERVED)* 52(RESERVED)* 53(RESERVED)* 54(RESERVED)* 55(RESERVED)* 56(RESERVED)* 57(RESERVED)* 58(DBG_RXD)* 59(DBG_TXD)* 60(RESERVED)* 61(RESERVED)* 62(RESERVED)* 63(RESERVED)* 64(RESERVED)* 65(RESERVED)* 66(RESERVED)* 67(RESERVED)* 68(RESERVED)* 69(RESERVED)* 70(RESERVED)* 71(RESERVED)* 72(RESERVED)* 73(RESERVED)* 74(RESERVED)* 75(RESERVED)* 76(RESERVED)* 77(RESERVED)* 78(RESERVED)* 79(RESERVED)* 80(RESERVED)* 81(RESERVED)* 82(RESERVED)* 83(RESERVED)* 84(RESERVED)* 85(RESERVED)* 86(RESERVED)*; SW1 1; SW2 1; SW3 1; SW4 1 4; SW5 1; SW6 1; SW7 1; SW8 1 4; SW9 1; SW10 1; SW11 1; SW12 1 4; SW13 1 4; U4 25(PB12)*

## Notes on the sheet
- MODULE SIM
- LEVEL SHIFRING
- BUTTON
- POWER
- (near SW1) CH1+
- (near SW2) CH1-
- (near SW3) CH2+
- (near SW4) CH2-
- (near SW7) CH4+
- (near SW8) CH4-
- IP2326
- (near SW5) CH3+
- (near SW6) CH3-
- (near SW9) UP
- (near SW10) DOWN
- (near SW11) BACK
- (near SW12) OK
- HEADER JOYSTICK_SWTICH_VR
- Dây màu đen là VCC
- Dây màu trắng là GND
- STM32
- JOYSTICK LEFT X
- (near J2) JOYSTICK LEFT Y
- (near J3) SWITCH LEFT
- TYPE C
- 4: Dây màu vàng
- 2: Dây màu đỏ
- JOYSTICK RIGHT X
- JOYSTICK RIGHT Y
- (near J5) SWITCH RIGHT
- VRA_VRB
- DUNG LƯỢNG PIN
- LCD_SPI
- LCD_I2C
- DWG. NO.
- REV.
- SHT.
- REVISION
- DESCRIPTION
- DATE
- APPROVED
- THIS DOCUMENT AND THE DATA DISCLOSED HEREIN OR HEREWITH IS THE PROPERTY OF ALTIUM LIMITED AND MAY BE FREELY DISTRIBUTED IN WHOLE. NO RIGHTS ARE RESERVED OR EXPRESS OR IMPLIED WARANTEE GIVEN.
- ENG:
- DSN:
- APPROVALS
- PROJECT
- DOCUMENT REVISION:
- DESIGN ITEM:
- CHK:
- BOM:
- REFERENCE DOCUMENTS
- PROJECT REVISION:
- TITLE
- FAB DWG:
- PCB DWG:
- ASSY DWG:
- SCALE:
- SIZE
- D
- CAGE CODE
- FILE NAME
- DWG NO.
- SHEET
- OF
- REV
- (in symbol BUZZ_9X5.5MM) +; -
- (in symbol CAP_ALU_SMD; 100UF 20% 16V 6.3x5.5MM) +
- (in symbol CAP_CER_SMD; 0.33UF 50V X7R 0805 10%) X7R
- (in symbol CAP_CER_SMD; 10PF 50V C0G/NP0 0805 2.5%) X5R
- (in symbol CAP_CER_SMD; 22PF 50V C0G/NP0 0805 5%) X7R
- (in symbol CAP_CER_SMD; 33PF 50V C0G/NP0 0805 10%) X7R
- (in symbol CAP_CER_SMD; 100PF 50V C0G/NP0 0805 10%) 0805; C0G
- (in symbol CAP_CER_SMD; 470PF 50V C0G/NP0 0805 5%) C0G
- (in symbol HOLE_3M_1) HOLE_3M
- (in symbol RES_SMD; 0R 5% 1/8W 0805) 0805
- (in symbol RES_SMD; 1K, 1%, 0805, 1/8W) 0805
- (in symbol RES_SMD; 4.7K, 1%, 0805, 1/8W) 0805
- (in symbol RES_SMD; 10K, 1%, 0805, 1/8W) 0805
- (in symbol RES_SMD; 22R, 1%, 0805, 1/8W) 0805
- (in symbol RES_SMD; 330R, 1%, 0805, 1/8W) 0805